# Altium schematic sheet JacobSimonSays.SchDoc
size 431 x 279 mm; SheetNumber: 1; SheetTotal: 1; ENG_APP_DATE: --/--/--; DSN_APP_DATE: --/--/--; CHK_APP_DATE: --/--/--
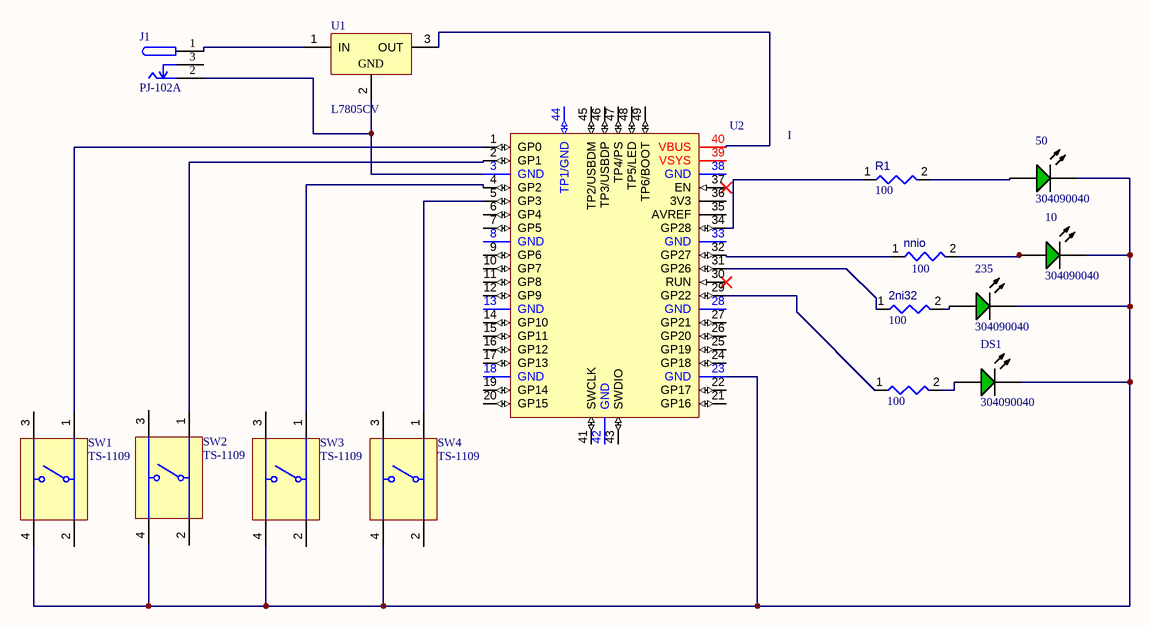
[diagram p0: JacobSimonSays.SchDoc]

## Parts
2ni32  value 100  [RESA60-630X240]  (hidden comment: MFR-25FBF52-100R)
10  304090040  [LED-2P-2.28-3MM]
50  304090040  [LED-2P-2.28-3MM]
235  304090040  [LED-2P-2.28-3MM]
?  value 100  [RESA60-630X240]  (hidden comment: MFR-25FBF52-100R)
DS1  304090040  [LED-2P-2.28-3MM]
J1  PJ-102A  [FP-PJ-102A-MFG]
nnio  value 100  [RESA60-630X240]  (hidden comment: MFR-25FBF52-100R)
R1  value 100  [RESA60-630X240]  (hidden comment: MFR-25FBF52-100R)
SW1  TS-1109  [BEST-TS-1109_V]
SW2  TS-1109  [BEST-TS-1109_V]
SW3  TS-1109  [BEST-TS-1109_V]
SW4  TS-1109  [BEST-TS-1109_V]
U1  L7805CV  [TO220]
U2  I  [RPI-PICO-MOD]

## Nets
Net2ni32_1: 2ni32.1 U2.31(GP26)
Net2ni32_2: 2ni32.2 235.1(A)
Net10_1: 10.1(A) nnio.2
Net10_2: 10.2(K) 50.2(K) 235.2(K) DS1.2(K) SW1.4 SW2.4 SW3.4 SW4.4 U2.23(GND)
Net50_1: 50.1(A) R1.2
Net?_1: ?.1 U2.29(GP22)
Net?_2: ?.2 DS1.1(A)
NetJ1_1: J1.1 U1.1(IN)
NetJ1_2: J1.2 U1.2(GND) U2.3(GND)
Netnnio_1: nnio.1 U2.32(GP27)
NetR1_1: R1.1 U2.34(GP28)
NetSW1_1: SW1.1 U2.1(GP0)
NetSW2_1: SW2.1 U2.2(GP1)
NetSW3_1: SW3.1 U2.4(GP2)
NetSW4_1: SW4.1 U2.5(GP3)
NetU1_3: U1.3(OUT) U2.40(VBUS)

Not connected (* = marked no-connect by the designer): J1 3; SW1 2 3; SW2 2 3; SW3 2 3; SW4 2 3; U2 6(GP4) 7(GP5) 8(GND) 9(GP6) 10(GP7) 11(GP8) 12(GP9) 13(GND) 14(GP10) 15(GP11) 16(GP12) 17(GP13) 18(GND) 19(GP14) 20(GP15) 21(GP16) 22(GP17) 24(GP18) 25(GP19) 26(GP20) 27(GP21) 28(GND) 30(RUN)* 33(GND) 35(AVREF) 36(3V3) 37(EN)* 38(GND) 39(VSYS) 41(SWCLK) 42(GND) 43(SWDIO) 44(TP1/GND) 45(TP2/USBDM) 46(TP3/USBDP) 47(TP4/PS) 48(TP5/LED) 49(TP6/BOOT)

## Notes on the sheet
- DWG. NO.
- REV.
- SHT.
- THIS DOCUMENT AND THE DATA DISCLOSED HEREIN OR HEREWITH IS THE PROPERTY OF ALTIUM LIMITED AND MAY BE FREELY DISTRIBUTED IN WHOLE. NO RIGHTS ARE RESERVED OR EXPRESS OR IMPLIED WARANTEE GIVEN.
- REVISION
- DESCRIPTION
- DATE
- APPROVED
- ENG:
- APPROVALS
- PROJECT
- DSN:
- CHK:
- REFERENCE DOCUMENTS
- PROJECT REVISION:
- TITLE
- DOCUMENT REVISION:
- DESIGN ITEM:
- BOM:
- FAB DWG:
- PCB DWG:
- ASSY DWG:
- SCALE:
- SIZE
- B
- CAGE CODE
- FILE NAME
- DWG NO.
- SHEET
- OF
- REV

## Library data of the parts
2ni32 ? nnio R1 = CMP-009-00046-4: Axial Resistor, 100 Ohm, +/- 1%, 0.25 W, -55 to 155 degC, 2-Pin THD, RoHS, Bulk; Manufacturer: Yageo; Voltage Rating: 250V; Power: 250mW; Packaging: Bulk; Max Operating Temperature: 155°C; Mounting Technology: TH; Datasheet Version: Apr-13; Case/Package: Axial; RoHS Compliant: True; Package Description: 2-Pin Axial Lead, Dia 2.4 mm, Body Length 6.3 mm; Package Quantity: 200; Package Reference: MFR-25; Tolerance: 1%; Composition: CarbonFilm; Datasheet URL: http://www.yageo.com/documents/recent/Yageo%20LR_MFR_2013.pdf; Manufacturer URL: http://www.yageo.com/; Min Operating Temperature: -55°C
10 50 235 DS1 = CMP-007-00006-2: Green LED, 80 mW, 20 mA, -25 to 85 degC, 2-Pin THD; Manufacturer: Shenzhen CGX; Manufacturer URL: http://szcgx.com/; Package Reference: 304090040; Datasheet Version: Rev. 1.0, 09/2014; RoHS Compliant: Unknown; Case/Package: 304090040; Package Description: 2-Pin Through Hole Device, Dia 3 mm, Pitch 2.28 mm; Datasheet URL: http://datasheet.octopart.com/304090040-Chengguangxing-datasheet-62330655.pdf; Mounting Technology: TH
J1 = CMP-12637-106234071-1: PJ-102A 2.0 x 6.5 mm, 2.5 A, Horizontal, Through Hole, Tapered Pins, Dc Power Jack Connector; Voltage Rating (DC): 24V; Number of Contacts: 3; Outside Diameter: 6.5mm; Gender: Male; Shielding: No; Insulation Resistance: 50MΩ; Current Rating: 2.5A; Inside Diameter: 2mm; Number of Conductors: 2; Housing Color: Black; RoHS: Compliant; Diameter: 2.1mm; Mount: Through Hole; Contact Plating: Nickel; NexarPartId: 106234071; Voltage Rating: 24V; Housing Material: Thermoplastic; Max Operating Temperature: 85°C; Color: Black; Contact Material: Copper, Nickel, Tin; Orientation: Horizontal; Packaging: Bulk; Flammability Rating: UL94 V-0; Schedule B: 8536695050, 8536695050; Contact Gender: Male; Lead Free: Lead Free; Termination: Through Hole; Min Operating Temperature: -25°C; Height: 11.2mm; Lifecycle Status: Production
SW1-SW4 = CMP-011-00002-2: Tactile Switch, SPST, 12 V, 50 mA, -20 to 80 degC, 4-Pin THD; Manufacturer: Shenzhen Best; RoHS Compliant: Unknown; Manufacturer URL: www.best-dz.com/; Case/Package: TS-1109; Package Reference: TS-1109; Datasheet Version: Dec-12; Mounting Technology: TH; Package Description: 4-Pin Through Hole Device, Body 6.2 x 6.2 mm; Datasheet URL: http://datasheet.octopart.com/TS-1109-Best-Inc.-datasheet-30458100.pdf
U1 = CMP-019-00018-3: Positive Voltage Regulator IC, 1.5 A, 5 V, 0 to 125 degC, 3-Pin TO-220, RoHS, Tube; Manufacturer: STMicroelectronics; Max Input Voltage: 35V; Min Supply Voltage: 8V; Nominal Output Voltage: 5V; Outputs: 1; Output Current: 1.5A; Dropout Voltage: 2V; Max Supply Voltage: 20V; Min Input Voltage: 7V; Datasheet Version: Rev 30, 09/2012; Min Operating Temperature: 0°C; Manufacturer URL: http://www.st.com/; Pins: 3; Mounting Technology: TH; Output Voltage: 5V; RoHS Compliant: True; Max Ouput Current: 1.5A; Datasheet URL: https://datasheet.ciiva.com/15111/getdatasheetpartid-44136-15111027.pdf; Packaging: Rail/Tube; Max Operating Temperature: 125°C; Case/Package: TO-220; Package Quantity: 50
U2 = RPI-PICO-MOD: RASPBERRY PI PICO RP2040 BOARD; Manufacturer: Raspberry Pi Foundation; Manufacturer Part No: SC0915; Mounting Technology: SMT; Supplier: DigiKey; Supplier Part No: 2648-SC0915CT-ND; Supplier Link: https://www.digikey.com/en/products/detail/raspberry-pi/SC0915/13684020